# Altium project NBP16 Xilinx Spartan-II PQ208 Rev1.01.PrjPcb
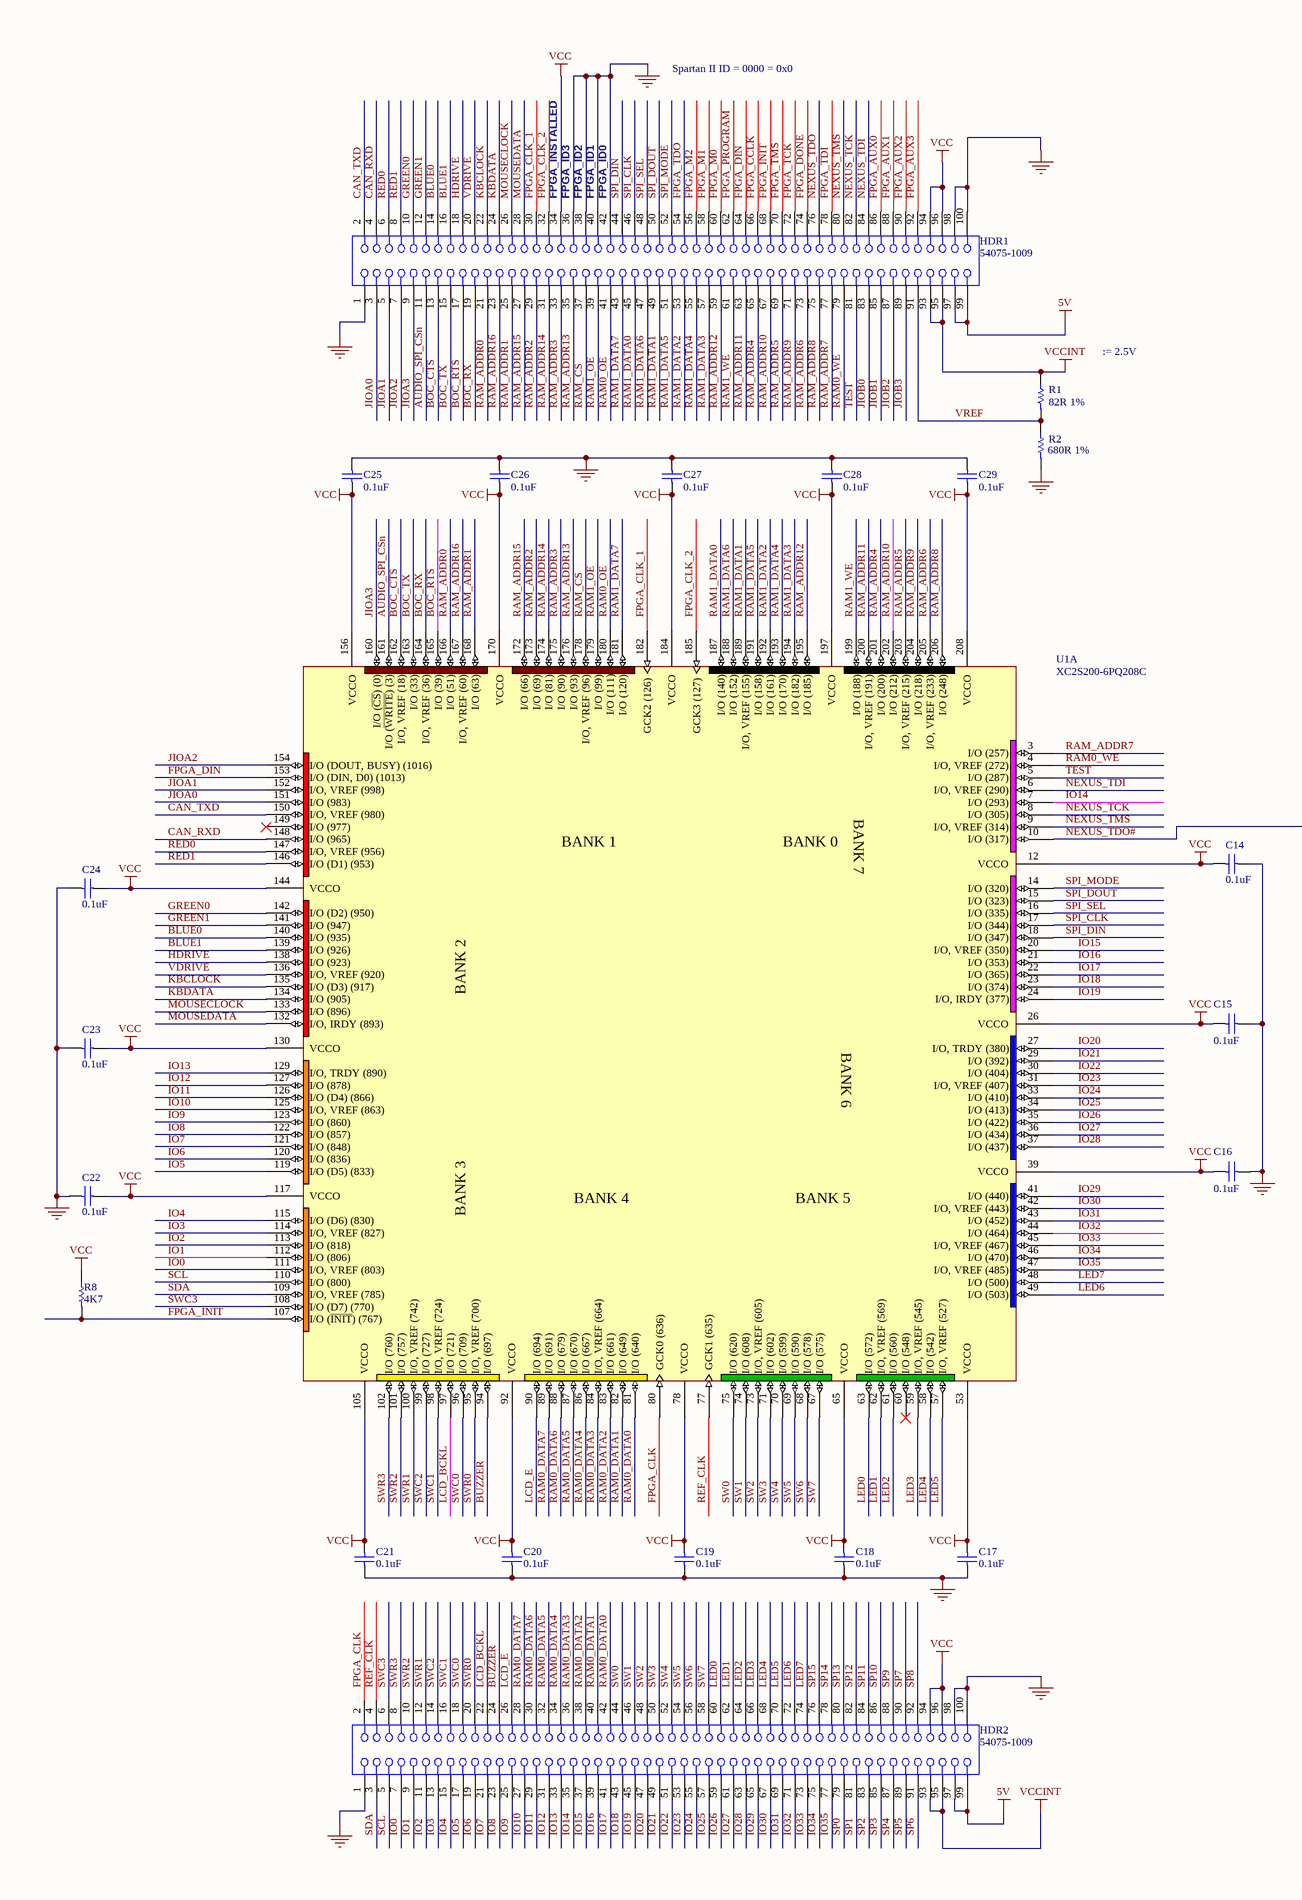
[diagram p0: NBP16 Xilinx Spartan-II PQ208 Rev1.01.SchDoc, left]
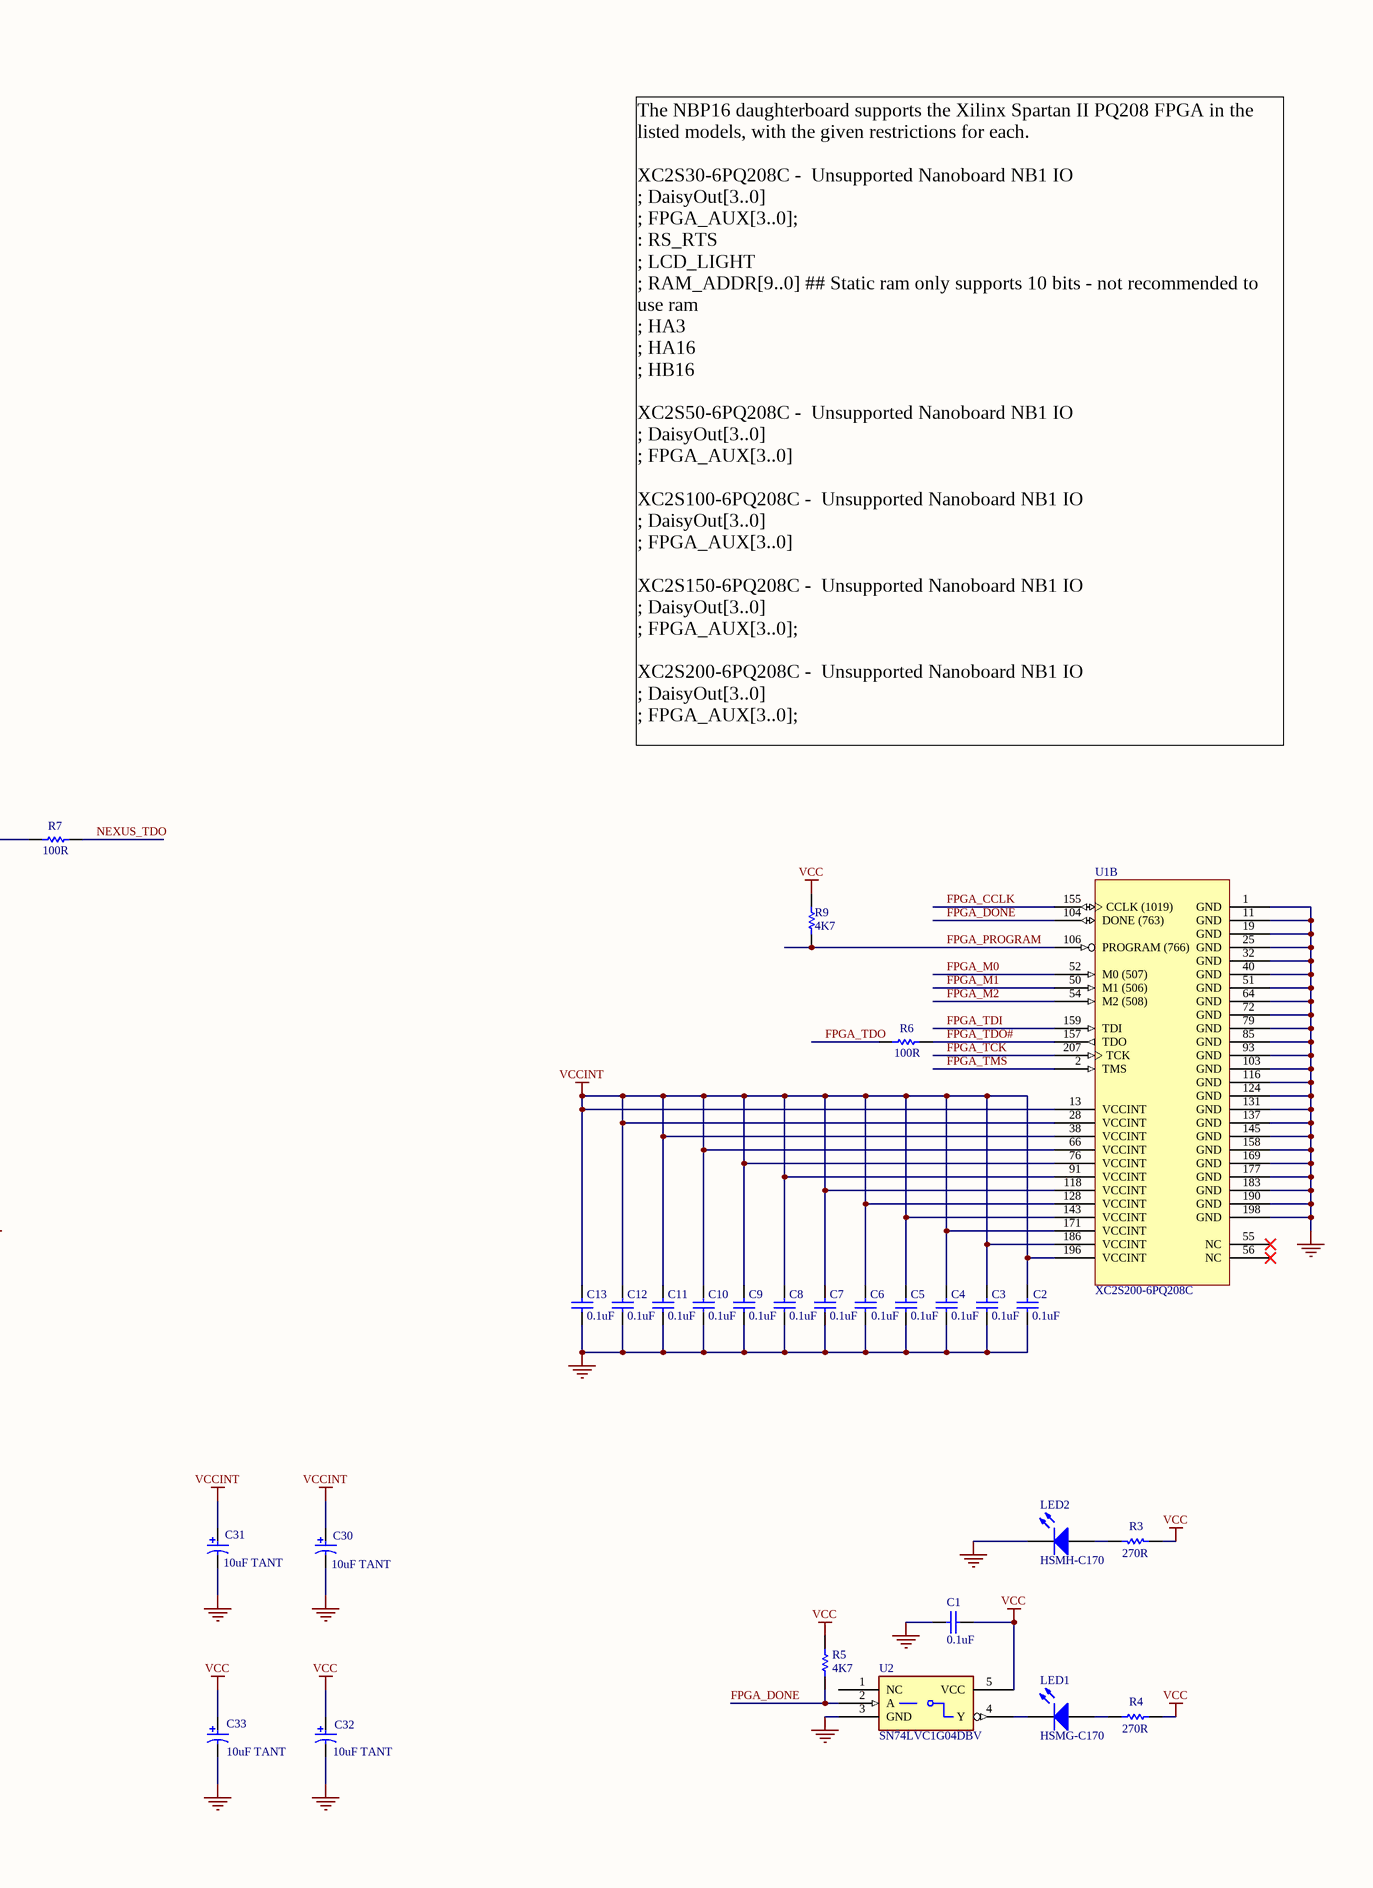
[diagram p1: NBP16 Xilinx Spartan-II PQ208 Rev1.01.SchDoc, right]
1 sheet, 48 parts. Net scope: global (net labels, ports and power ports of the same name join across sheets).
Board file: NBP16 Xilinx Spartan-II PQ208 Rev1.01.PcbDoc

## Sheet NBP16 Xilinx Spartan-II PQ208 Rev1.01.SchDoc: Xilinx Spartan II Daughter Board
size A2; Organization: Altium Limited; Address1: L3, 12a Rodborough Rd; Address2: Frenchs Forest; Address3: NSW; Address4: Australia 2086; DocumentNumber: 1; Revision: 1.01; SheetNumber: 1; SheetTotal: 1

### Parts
C1  0.1uF  [CC2012-0805]
C2  0.1uF  [CC1608-0603]
C3  0.1uF  [CC1608-0603]
C4  0.1uF  [CC1608-0603]
C5  0.1uF  [CC1608-0603]
C6  0.1uF  [CC1608-0603]
C7  0.1uF  [CC1608-0603]
C8  0.1uF  [CC1608-0603]
C9  0.1uF  [CC1608-0603]
C10  0.1uF  [CC1608-0603]
C11  0.1uF  [CC1608-0603]
C12  0.1uF  [CC1608-0603]
C13  0.1uF  [CC1608-0603]
C14  0.1uF  [CC1608-0603]
C15  0.1uF  [CC1608-0603]
C16  0.1uF  [CC1608-0603]
C17  0.1uF  [CC1608-0603]
C18  0.1uF  [CC1608-0603]
C19  0.1uF  [CC1608-0603]
C20  0.1uF  [CC1608-0603]
C21  0.1uF  [CC1608-0603]
C22  0.1uF  [CC1608-0603]
C23  0.1uF  [CC1608-0603]
C24  0.1uF  [CC1608-0603]
C25  0.1uF  [CC1608-0603]
C26  0.1uF  [CC1608-0603]
C27  0.1uF  [CC1608-0603]
C28  0.1uF  [CC1608-0603]
C29  0.1uF  [CC1608-0603]
C30  10uF TANT  [MCCT-B]
C31  10uF TANT  [MCCT-B]
C32  10uF TANT  [MCCT-B]
C33  10uF TANT  [MCCT-B]
HDR1  54075-1009  [54075]
HDR2  54075-1009  [54075]
LED1  HSMG-C170  [SMD _LED]
LED2  HSMH-C170  [SMD _LED]
R1  82R 1%  [CC2012-0805]
R2  680R 1%  [CC2012-0805]
R3  270R  [CC2012-0805]
R4  270R  [CC2012-0805]
R5  4K7  [CC2012-0805]
R6  100R  [CC2012-0805]
R7  100R  [CC2012-0805]
R8  4K7  [CC2012-0805]
R9  4K7  [CC2012-0805]
U1  XC2S200-6PQ208C  [F-QFP28X28-G208/P.5N]  (parts A,B of 2)
U2  SN74LVC1G04DBV  [SO-G5/P.95]

### Nets
5V: HDR1.97 HDR1.99 HDR2.97 HDR2.99
GND: C1.1 C2.2 C3.2 C4.2 C5.2 C6.2 C7.2 C8.2 C9.2 C10.2 C11.2 C12.2 C13.2 C14.2 C15.2 C16.2 C17.1 C18.1 C19.1 C20.1 C21.1 C22.2 C23.2 C24.2 C25.1 C26.1 C27.1 C28.1 C29.1 C30.2 C31.2 C32.2 C33.2 HDR1.1 HDR1.36 HDR1.38 HDR1.40 HDR1.42 HDR1.98 HDR1.100 HDR2.1 HDR2.98 HDR2.100 LED2.2(K) R2.2 U1.1(GND) U1.11(GND) U1.19(GND) U1.25(GND) U1.32(GND) U1.40(GND) U1.51(GND) U1.64(GND) U1.72(GND) U1.79(GND) U1.85(GND) U1.93(GND) U1.103(GND) U1.116(GND) U1.124(GND) U1.131(GND) U1.137(GND) U1.145(GND) U1.158(GND) U1.169(GND) U1.177(GND) U1.183(GND) U1.190(GND) U1.198(GND) U2.3(GND)
VCC: C1.2 C14.1 C15.1 C16.1 C17.2 C18.2 C19.2 C20.2 C21.2 C22.1 C23.1 C24.1 C25.2 C26.2 C27.2 C28.2 C29.2 C32.1 C33.1 HDR1.34 HDR1.94 HDR1.96 HDR2.94 HDR2.96 R3.1 R4.2 R5.1 R8.1 R9.1 U1.12(VCCO) U1.26(VCCO) U1.39(VCCO) U1.53(VCCO) U1.65(VCCO) U1.78(VCCO) U1.92(VCCO) U1.105(VCCO) U1.117(VCCO) U1.130(VCCO) U1.144(VCCO) U1.156(VCCO) U1.170(VCCO) U1.184(VCCO) U1.197(VCCO) U1.208(VCCO) U2.5(VCC)
VCCINT: C2.1 C3.1 C4.1 C5.1 C6.1 C7.1 C8.1 C9.1 C10.1 C11.1 C12.1 C13.1 C30.1 C31.1 HDR1.93 HDR1.95 HDR2.93 HDR2.95 R1.1 U1.13(VCCINT) U1.28(VCCINT) U1.38(VCCINT) U1.66(VCCINT) U1.76(VCCINT) U1.91(VCCINT) U1.118(VCCINT) U1.128(VCCINT) U1.143(VCCINT) U1.171(VCCINT) U1.186(VCCINT) U1.196(VCCINT)
AUDIO_SPI_CSn: HDR1.11 U1.161(I/O_(~{WRITE})_(3))
BLUE0: HDR1.14 U1.140(I/O_(935))
BLUE1: HDR1.16 U1.139(I/O_(926))
BOC_CTS: HDR1.13 U1.162(I/O,_VREF_(18))
BOC_RTS: HDR1.17 U1.165(I/O_(39))
BOC_RX: HDR1.19 U1.164(I/O,_VREF_(36))
BOC_TX: HDR1.15 U1.163(I/O_(33))
BUZZER: HDR2.24 U1.94(I/O_(697))
CAN_RXD: HDR1.4 U1.148(I/O_(965))
CAN_TXD: HDR1.2 U1.150(I/O,_VREF_(980))
FPGA_AUX0: HDR1.86
FPGA_AUX1: HDR1.88
FPGA_AUX2: HDR1.90
FPGA_AUX3: HDR1.92
FPGA_CCLK: HDR1.66 U1.155(CCLK_(1019))
FPGA_CLK: HDR2.2 U1.80(GCK0_(636))
FPGA_CLK_1: HDR1.30 U1.182(GCK2_(126))
FPGA_CLK_2: HDR1.32 U1.185(GCK3_(127))
FPGA_DIN: HDR1.64 U1.153(I/O_(DIN,_D0)_(1013))
FPGA_DONE: HDR1.74 R5.2 U1.104(DONE_(763)) U2.2(A)
FPGA_INIT: HDR1.68 R8.2 U1.107(I/O_(~{INIT})_(767))
FPGA_M0: HDR1.60 U1.52(M0_(507))
FPGA_M1: HDR1.58 U1.50(M1_(506))
FPGA_M2: HDR1.56 U1.54(M2_(508))
FPGA_PROGRAM: HDR1.62 R9.2 U1.106(PROGRAM_(766))
FPGA_TCK: HDR1.72 U1.207(TCK)
FPGA_TDI: HDR1.78 U1.159(TDI)
FPGA_TDO: HDR1.54 R6.1
FPGA_TDO#: R6.2 U1.157(TDO)
FPGA_TMS: HDR1.70 U1.2(TMS)
GREEN0: HDR1.10 U1.142(I/O_(D2)_(950))
GREEN1: HDR1.12 U1.141(I/O_(947))
HDRIVE: HDR1.18 U1.138(I/O_(923))
IO0: HDR2.7 U1.111(I/O,_VREF_(803))
IO1: HDR2.9 U1.112(I/O_(806))
IO2: HDR2.11 U1.113(I/O_(818))
IO3: HDR2.13 U1.114(I/O,_VREF_(827))
IO4: HDR2.15 U1.115(I/O_(D6)_(830))
IO5: HDR2.17 U1.119(I/O_(D5)_(833))
IO6: HDR2.19 U1.120(I/O_(836))
IO7: HDR2.21 U1.121(I/O_(848))
IO8: HDR2.23 U1.122(I/O_(857))
IO9: HDR2.25 U1.123(I/O_(860))
IO10: HDR2.27 U1.125(I/O,_VREF_(863))
IO11: HDR2.29 U1.126(I/O_(D4)_(866))
IO12: HDR2.31 U1.127(I/O_(878))
IO13: HDR2.33 U1.129(I/O,_TRDY_(890))
IO14: HDR2.35 U1.7(I/O_(293))
IO15: HDR2.37 U1.20(I/O,_VREF_(350))
IO16: HDR2.39 U1.21(I/O_(353))
IO17: HDR2.41 U1.22(I/O_(365))
IO18: HDR2.43 U1.23(I/O_(374))
IO19: HDR2.45 U1.24(I/O,_IRDY_(377))
IO20: HDR2.47 U1.27(I/O,_TRDY_(380))
IO21: HDR2.49 U1.29(I/O_(392))
IO22: HDR2.51 U1.30(I/O_(404))
IO23: HDR2.53 U1.31(I/O,_VREF_(407))
IO24: HDR2.55 U1.33(I/O_(410))
IO25: HDR2.57 U1.34(I/O_(413))
IO26: HDR2.59 U1.35(I/O_(422))
IO27: HDR2.61 U1.36(I/O_(434))
IO28: HDR2.63 U1.37(I/O_(437))
IO29: HDR2.65 U1.41(I/O_(440))
IO30: HDR2.67 U1.42(I/O,_VREF_(443))
IO31: HDR2.69 U1.43(I/O_(452))
IO32: HDR2.71 U1.44(I/O_(464))
IO33: HDR2.73 U1.45(I/O,_VREF_(467))
IO34: HDR2.75 U1.46(I/O_(470))
IO35: HDR2.77 U1.47(I/O,_VREF_(485))
JIOA0: HDR1.3 U1.151(I/O_(983))
JIOA1: HDR1.5 U1.152(I/O,_VREF_(998))
JIOA2: HDR1.7 U1.154(I/O_(DOUT,_BUSY)_(1016))
JIOA3: HDR1.9 U1.160(I/O_(~{CS})_(0))
JIOB0: HDR1.83
JIOB1: HDR1.85
JIOB2: HDR1.87
JIOB3: HDR1.89
KBCLOCK: HDR1.22 U1.135(I/O_(D3)_(917))
KBDATA: HDR1.24 U1.134(I/O_(905))
LCD_BCKL: HDR2.22 U1.97(I/O_(721))
LCD_E: HDR2.26 U1.90(I/O_(694))
LED0: HDR2.60 U1.63(I/O_(572))
LED1: HDR2.62 U1.62(I/O,_VREF_(569))
LED2: HDR2.64 U1.61(I/O_(560))
LED3: HDR2.66 U1.59(I/O,_VREF_(545))
LED4: HDR2.68 U1.58(I/O_(542))
LED5: HDR2.70 U1.57(I/O,_VREF_(527))
LED6: HDR2.72 U1.49(I/O_(503))
LED7: HDR2.74 U1.48(I/O_(500))
MOUSECLOCK: HDR1.26 U1.133(I/O_(896))
MOUSEDATA: HDR1.28 U1.132(I/O,_IRDY_(893))
NEXUS_TCK: HDR1.82 U1.8(I/O_(305))
NEXUS_TDI: HDR1.84 U1.6(I/O,_VREF_(290))
NEXUS_TDO: HDR1.76 R7.2
NEXUS_TDO#: R7.1 U1.10(I/O_(317))
NEXUS_TMS: HDR1.80 U1.9(I/O,_VREF_(314))
RAM0_DATA0: HDR2.42 U1.81(I/O_(640))
RAM0_DATA1: HDR2.40 U1.82(I/O_(649))
RAM0_DATA2: HDR2.38 U1.83(I/O_(661))
RAM0_DATA3: HDR2.36 U1.84(I/O,_VREF_(664))
RAM0_DATA4: HDR2.34 U1.86(I/O_(667))
RAM0_DATA5: HDR2.32 U1.87(I/O_(670))
RAM0_DATA6: HDR2.30 U1.88(I/O_(679))
RAM0_DATA7: HDR2.28 U1.89(I/O_(691))
RAM0_OE: HDR1.41 U1.180(I/O_(111))
RAM0_WE: HDR1.79 U1.4(I/O,_VREF_(272))
RAM1_DATA0: HDR1.45 U1.187(I/O_(140))
RAM1_DATA1: HDR1.49 U1.189(I/O,_VREF_(155))
RAM1_DATA2: HDR1.53 U1.192(I/O_(161))
RAM1_DATA3: HDR1.57 U1.194(I/O_(182))
RAM1_DATA4: HDR1.55 U1.193(I/O_(170))
RAM1_DATA5: HDR1.51 U1.191(I/O_(158))
RAM1_DATA6: HDR1.47 U1.188(I/O_(152))
RAM1_DATA7: HDR1.43 U1.181(I/O_(120))
RAM1_OE: HDR1.39 U1.179(I/O_(99))
RAM1_WE: HDR1.61 U1.199(I/O_(188))
RAM_ADDR0: HDR1.21 U1.166(I/O_(51))
RAM_ADDR1: HDR1.25 U1.168(I/O_(63))
RAM_ADDR2: HDR1.29 U1.173(I/O_(69))
RAM_ADDR3: HDR1.33 U1.175(I/O_(90))
RAM_ADDR4: HDR1.65 U1.201(I/O_(200))
RAM_ADDR5: HDR1.69 U1.203(I/O,_VREF_(215))
RAM_ADDR6: HDR1.73 U1.205(I/O,_VREF_(233))
RAM_ADDR7: HDR1.77 U1.3(I/O_(257))
RAM_ADDR8: HDR1.75 U1.206(I/O_(248))
RAM_ADDR9: HDR1.71 U1.204(I/O_(218))
RAM_ADDR10: HDR1.67 U1.202(I/O_(212))
RAM_ADDR11: HDR1.63 U1.200(I/O,_VREF_(191))
RAM_ADDR12: HDR1.59 U1.195(I/O_(185))
RAM_ADDR13: HDR1.35 U1.176(I/O_(93))
RAM_ADDR14: HDR1.31 U1.174(I/O_(81))
RAM_ADDR15: HDR1.27 U1.172(I/O_(66))
RAM_ADDR16: HDR1.23 U1.167(I/O,_VREF_(60))
RAM_CS: HDR1.37 U1.178(I/O,_VREF_(96))
RED0: HDR1.6 U1.147(I/O,_VREF_(956))
RED1: HDR1.8 U1.146(I/O_(D1)_(953))
REF_CLK: HDR2.4 U1.77(GCK1_(635))
SCL: HDR2.5 U1.110(I/O_(800))
SDA: HDR2.3 U1.109(I/O,_VREF_(785))
SP0: HDR2.79
SP1: HDR2.81
SP2: HDR2.83
SP3: HDR2.85
SP4: HDR2.87
SP5: HDR2.89
SP6: HDR2.91
SP7: HDR2.90
SP8: HDR2.92
SP9: HDR2.88
SP10: HDR2.86
SP11: HDR2.84
SP12: HDR2.82
SP13: HDR2.80
SP14: HDR2.78
SP15: HDR2.76
SPI_CLK: HDR1.46 U1.17(I/O_(344))
SPI_DIN: HDR1.44 U1.18(I/O_(347))
SPI_DOUT: HDR1.50 U1.15(I/O_(323))
SPI_MODE: HDR1.52 U1.14(I/O_(320))
SPI_SEL: HDR1.48 U1.16(I/O_(335))
SW0: HDR2.44 U1.75(I/O_(620))
SW1: HDR2.46 U1.74(I/O_(608))
SW2: HDR2.48 U1.73(I/O,_VREF_(605))
SW3: HDR2.50 U1.71(I/O_(602))
SW4: HDR2.52 U1.70(I/O_(599))
SW5: HDR2.54 U1.69(I/O_(590))
SW6: HDR2.56 U1.68(I/O_(578))
SW7: HDR2.58 U1.67(I/O_(575))
SWC0: HDR2.18 U1.96(I/O_(709))
SWC1: HDR2.16 U1.98(I/O,_VREF_(724))
SWC2: HDR2.14 U1.99(I/O_(727))
SWC3: HDR2.6 U1.108(I/O_(D7)_(770))
SWR0: HDR2.20 U1.95(I/O,_VREF_(700))
SWR1: HDR2.12 U1.100(I/O,_VREF_(742))
SWR2: HDR2.10 U1.101(I/O_(757))
SWR3: HDR2.8 U1.102(I/O_(760))
TEST: HDR1.81 U1.5(I/O_(287))
VDRIVE: HDR1.20 U1.136(I/O,_VREF_(920))
VREF: HDR1.91 R1.2 R2.1
NetLED1_1: LED1.1(A) R4.1
NetLED1_2: LED1.2(K) U2.4(Y)
NetLED2_1: LED2.1(A) R3.2

Not connected (* = marked no-connect by the designer): U1 55(NC)* 56(NC)* 60(I/O_(548))* 149(I/O_(977))*; U2 1(NC)

### Notes on the sheet
- Spartan II ID = 0000 = 0x0
- (near HDR1) FPGA_INSTALLED
- (near HDR1) FPGA_ID3
- (near HDR1) FPGA_ID2
- (near HDR1) FPGA_ID1
- (near HDR1) FPGA_ID0
- := 2.5V
- The NBP16 daughterboard supports the Xilinx Spartan II PQ208 FPGA in the listed models, with the given restrictions for each.
  XC2S30-6PQ208C -  Unsupported Nanoboard NB1 IO
  ; DaisyOut[3..0]
  ; FPGA_AUX[3..0];
  : RS_RTS
  ; LCD_LIGHT
  ; RAM_ADDR[9..0] ## Static ram only supports 10 bits - not recommended to use ram
  ; HA3
  ; HA16
  ; HB16
  XC2S50-6PQ208C -  Unsupported Nanoboard NB1 IO
  ; DaisyOut[3..0]
  ; FPGA_AUX[3..0]
  XC2S100-6PQ208C -  Unsupported Nanoboard NB1 IO
  ; DaisyOut[3..0]
  ; FPGA_AUX[3..0]
  XC2S150-6PQ208C -  Unsupported Nanoboard NB1 IO
  ; DaisyOut[3..0]
  ; FPGA_AUX[3..0];
  XC2S200-6PQ208C -  Unsupported Nanoboard NB1 IO
  ; DaisyOut[3..0]
  ; FPGA_AUX[3..0];
- Title
- Size:
- Date:
- File:
- A2
- Number:
- Time:
- Revision:
- Sheet
- of
- (in symbol XC2S200-6PQ208C, part A) BANK 1; BANK 0; BANK 7; BANK 2; BANK 6; BANK 3; BANK 4; BANK 5

### Library data of the parts
C1-C29 = CAP: Capacitor
C30-C33 = CAP_POLAR: Polar Capacitor
HDR1 HDR2 = 54075-1009: Board-to-Board, Docking Station, 0.80mm (.031") Pitch, Shielded Receptacle, Vertical, Ultra Low Profile, SMT; Manufacturer: Molex; Package Information: Latest Revision: Jun-2001; Mating Height: 8.5mm; Voltage: 100V; Current: 0.5A; Contact Resistance: 40mOhm max; PCB Layout: Complies with Manufacturer's Recommendation.; Published: 15-Oct-2003; Datasheet: Latest Revision: Feb-2002; Package Reference: 54075; Publisher: Altium Limited
LED1 LED2 = HSMX-C670: Typical RED GaAs SMD LED Agilent make; Manufacturer: Generic Components; Class I: Optoelectronic; Fitted: True; Published: 8-Jun-2000; Revision: July-2002: Re-released for DXP Platform.; Publisher: Altium Limited; Class II: LED
R1-R9 = RES: Resistor
U1 = XC2S200-6PQ208C: Spartan-II 2.5V FPGA, 208-Pin PQFP, Higher Performance, Commercial Grade; Package Information: Latest Revision: ver1.1, Oct-2002; Code - JEDEC: MS-029-FA-1; Published: 13-Jul-2001; Revision: 17-Jul-2002: Re-released for DXP Platform.; Datasheet: Latest Revision: Sep-2003; Package Reference: PQ208; Publisher: Altium Limited
U2 = SN74AHC1G04DBVR: Manufacturer: TI; Fitted: True